# EAGLE design tiny85SOIC8_ICSP_PiggyBack_PTH (EAGLE 6.1)
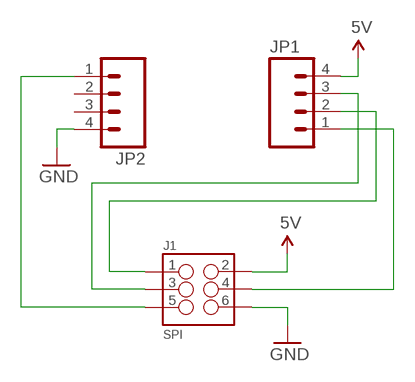
[diagram p0: schematic, sheet 1]

## Parts
J1  SPI  M03X2NO_SILK  [2X3-NS]
JP1  M041.27MM  [1X04-1.27MM]
JP2  M041.27MM  [1X04-1.27MM]

## Nets
5V: J1.2 JP1.4
GND: J1.6 JP2.4
MISO: J1.1 JP1.2
MOSI: J1.4 JP1.1
RST: J1.5 JP2.1
SCK: J1.3 JP1.3
Unconnected: JP2.2 JP2.3

## Library data of the parts
J1 = SparkFun-Connectors:M03X2: 2x3 .1" header. Shrouded, with keying- CONN-10681 SMT- CONN-11415 Pogo pins- HW-11044
JP1 JP2 = SparkFun-Connectors:M04: Header 4 Standard 4-pin 0.1" header. Use with straight break away headers (SKU : PRT-00116), right angle break away headers (PRT-00553), swiss pins (PRT-00743), machine pins (PRT-00117), and female headers (PRT-00115). Molex polarized connector foot print use with SKU : PRT-08231 with associated crimp pins and housings. 1MM SMD Version SKU: PRT-10208

## Board
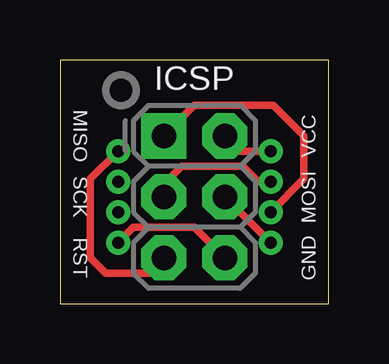
[diagram p1: board, top side]
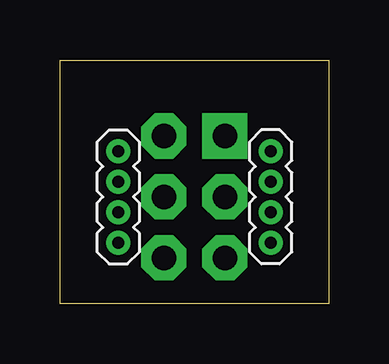
[diagram p2: board, bottom side, seen from below]

Size 11.2 x 10.15 mm. Coordinates in mm from the lower left corner, seen from the top.
Outline: 0,0 11.2,0 11.2,10.15 0,10.15 0,0
Copper layers (1*2*15*16): Top 0.035mm / dielectric 0.2mm / Route2 0.0175mm / dielectric 1.1mm / Route15 0.0175mm / dielectric 0.2mm / Bottom 0.035mm
Design rules: minimum track width 6mil, minimum drill 12mil, track to track 6mil, track to pad 6mil, pad to pad 6mil, via to via 6mil, smd to smd 0mil, copper to edge 10mil, drill to drill 10mil, minimum pad ring 6mil, minimum via ring 6mil, stop-mask expansion 2mil, vias tented up to drill 25mil, thermal gap 10mil

### Footprints (pad centres in the part's own frame; a part is rotated, then mirrored left to right if it is on the bottom)
2X3-NS = drill 1.016 pad 1.88 square: 1 -2.54,-1.27 | drill 1.016 pad 1.88 octagon: 2 -2.54,1.27; 3 0,-1.27; 4 0,1.27; 5 2.54,-1.27; 6 2.54,1.27
1X04-1.27MM = drill 0.508 pad 1: 1 0,0; 2 1.27,0; 3 2.54,0; 4 3.81,0

### Placement (x,y rotation side)
J1  5.6,4.45 270 top
JP1  8.78,2.54 90 bottom
JP2  2.42,6.35 270 bottom

### Tracks (layer width: path | path; a pad name or v marks a point on that pad's centre or on a via)
5V
  Top 0.305: J1.2 7.5,6.35 JP1.4
GND
  Top 0.305: JP2.4 3.06,3.17 5.6,3.17 J1.6
MISO
  Top 0.305: J1.1 5.6,8.26 8.89,8.26 10.16,6.99 10.16,5.2 JP1.2
MOSI
  Top 0.305: J1.4 JP1.1
RST
  Top 0.305: J1.5 3.69,1.27 1.91,1.27 1.27,1.91 1.27,5.2 JP2.1
SCK
  Top 0.305: J1.3 4.33,4.96 5.08,5.71 7.62,5.71 8.26,5.08 JP1.3

### Text on the board
tPlace: ICSP | MISO | VCC | SCK | MOSI | RST | GND